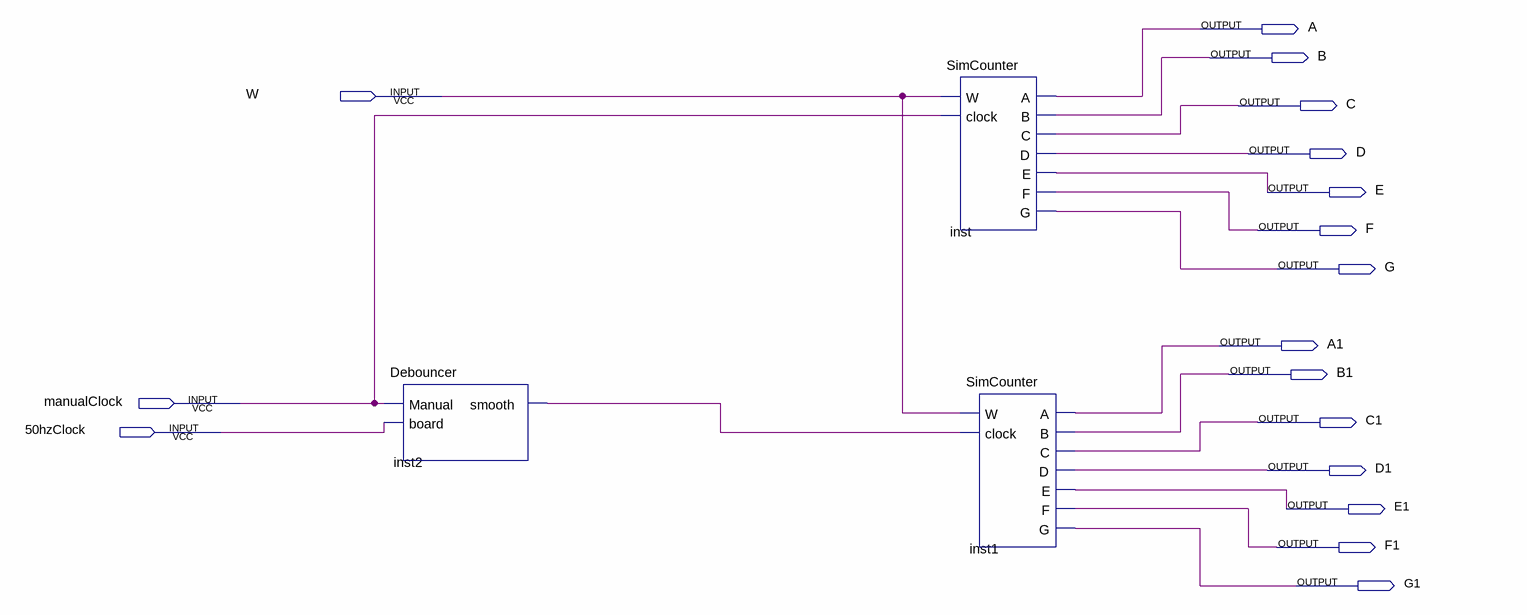
[diagram p0: schematic sheet]
// Quartus schematic de2.bdf as structural Verilog: 3 symbols, 17 pins
module de2 (
  input  W,
  input  manualClock,
  input  \50hzClock ,
  output A,
  output B,
  output C,
  output D,
  output E,
  output F,
  output G,
  output A1,
  output B1,
  output C1,
  output D1,
  output E1,
  output F1,
  output G1
);

  wire inst2_smooth;

  Debouncer inst2 (.Manual(manualClock), .board(\50hzClock ), .smooth(inst2_smooth));
  SimCounter inst (.W(W), .clock(manualClock), .A(A), .B(B), .C(C), .D(D), .E(E), .F(F), .G(G));
  SimCounter inst1 (.W(W), .clock(inst2_smooth), .A(A1), .B(B1), .C(C1), .D(D1), .E(E1), .F(F1), .G(G1));
endmodule
